# EAGLE design C64C-C128-multikernal (EAGLE 7.6.0)
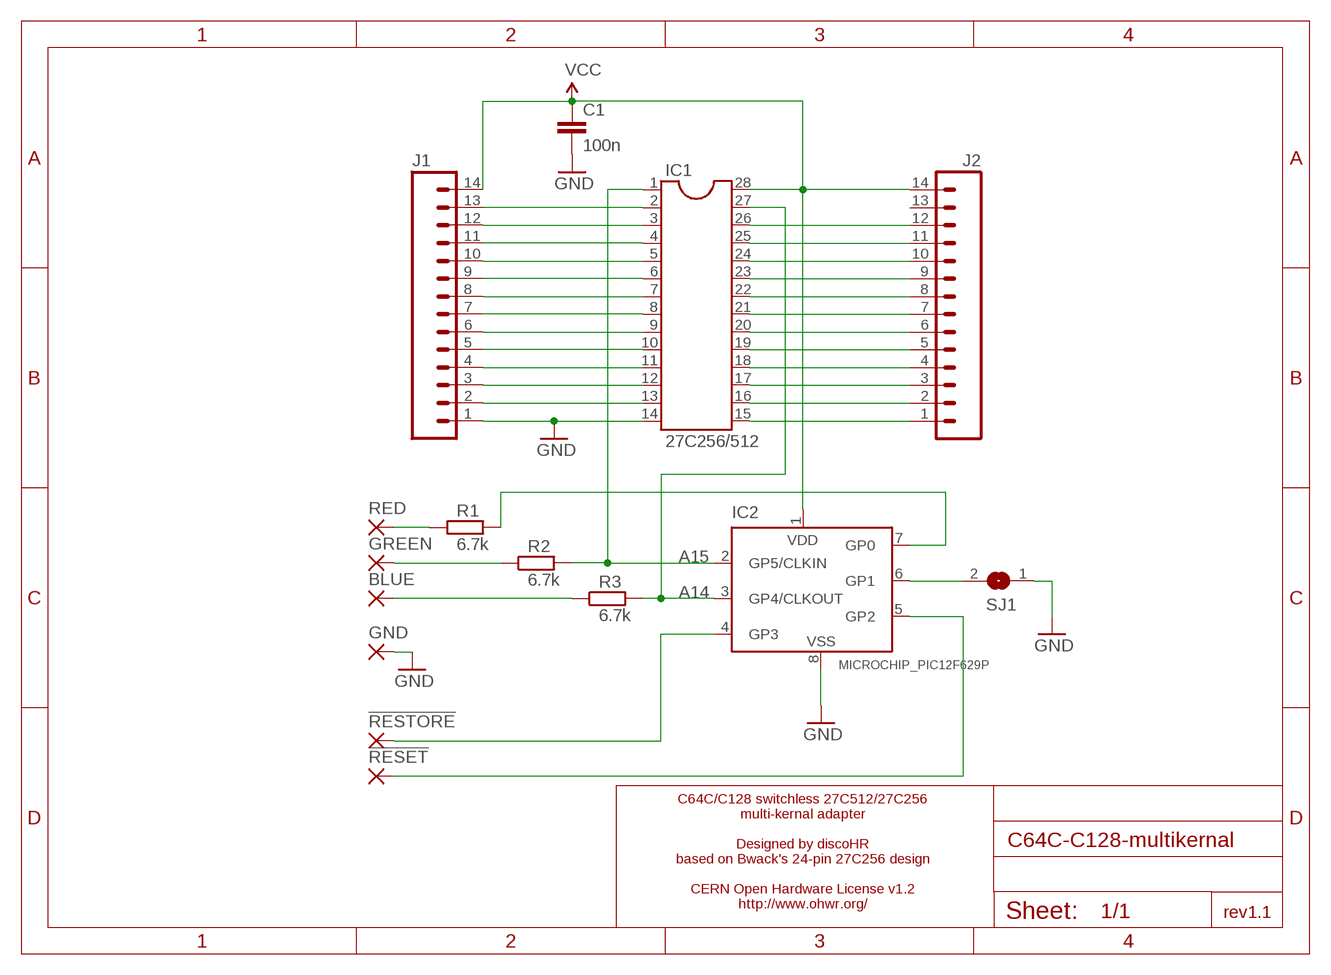
[diagram p0: schematic, sheet 1]

## Parts
!RESET!  2,15/1,0  [2,15/1,0]
!RESTORE!  2,15/1,0  [2,15/1,0]
BLUE  2,15/1,0  [2,15/1,0]
C1  100n  C-EU025-024X044  [C025-024X044]
GND  2,15/1,0  [2,15/1,0]
GREEN  2,15/1,0  [2,15/1,0]
IC1  27C256/512  IC-PACKAGE_EDIT_DIL28ROUND  [IC-PACKAGE_EDIT_DIL28SPECIAL]
IC2  MICROCHIP_PIC12F629P  [MICROCHIP_DIL8]
J1  M14  [1X14]
J2  M14  [1X14]
R1  6.7k  RCL_R-EU_0207/10  [RCL_0207/10]
R2  6.7k  RCL_R-EU_0207/10  [RCL_0207/10]
R3  6.7k  RCL_R-EU_0207/10  [RCL_0207/10]
RED  2,15/1,0  [2,15/1,0]
SJ1  SJ  [SJ]

## Nets
A14: IC1.27 IC2.3(GP4/CLKOUT) R3.2
A15: IC1.1 IC2.2(GP5/CLKIN) R2.2
GND [power]: C1.2 GND.1(P) IC1.14 IC2.8(VSS) J1.1 SJ1.1
N$1: IC2.7(GP0) R1.2
N$2: R1.1 RED.1(P)
N$3: IC1.15 J2.1
N$4: IC1.16 J2.2
N$5: IC1.17 J2.3
N$6: IC1.18 J2.4
N$7: IC1.19 J2.5
N$8: IC1.20 J2.6
N$9: IC1.21 J2.7
N$10: IC1.22 J2.8
N$11: IC1.23 J2.9
N$12: IC1.24 J2.10
N$13: IC1.25 J2.11
N$14: IC1.26 J2.12
N$15: IC1.2 J1.13
N$16: IC2.6(GP1) SJ1.2
N$17: IC1.3 J1.12
N$18: IC1.4 J1.11
N$19: IC1.5 J1.10
N$20: IC1.6 J1.9
N$21: IC1.7 J1.8
N$22: IC1.8 J1.7
N$23: IC1.9 J1.6
N$24: IC1.10 J1.5
N$25: IC1.11 J1.4
N$26: IC1.12 J1.3
N$27: IC1.13 J1.2
N$28: !RESET!.1(P) IC2.5(GP2)
N$29: GREEN.1(P) R2.1
N$30: BLUE.1(P) R3.1
N$31: !RESTORE!.1(P) IC2.4(GP3)
VCC [power]: C1.1 IC1.28 IC2.1(VDD) J1.14 J2.14
Unconnected: J2.13

## Notes on the sheet
- C64C/C128 switchless 27C512/27C256
  multi-kernal adapter
  
  Designed by discoHR
  based on Bwack's 24-pin 27C256 design
  
  CERN Open Hardware License v1.2
  http://www.ohwr.org/
- rev1.1

## Library data of the parts
!RESET! !RESTORE! BLUE GND GREEN RED = wirepad:2,15/1,0: THROUGH-HOLE PAD
C1 = rcl:C-EU: CAPACITOR, European symbol
IC1 = c64switchless:IC-PACKAGE_EDIT_DIL28: Dual In Line
IC2 = c64switchless:MICROCHIP_PIC12F6*: Data Sheet 8-Pin FLASH-Based 8-Bit CMOS Microcontrollers Source: http://www.microchip.com .. 41190c.pdf; MF: MICROCHIP; MPN: PIC12F629-I/P; OC_FARNELL: 1292253; OC_NEWARK: 67K0822
J1 J2 = SparkFun-Connectors:M14: Header 14 Standard 14-pin 0.1" header. Use with straight break away headers (SKU : PRT-00116), right angle break away headers (PRT-00553), swiss pins (PRT-00743), machine pins (PRT-00117), and female headers (PRT-00115).
R1-R3 = c64switchless:RCL_R-EU_: RESISTOR, European symbol
SJ1 = jumper:SJ: SMD solder JUMPER

## Net classes
0 default: width 0.406 mm
1 power: width 0.61 mm

## Board
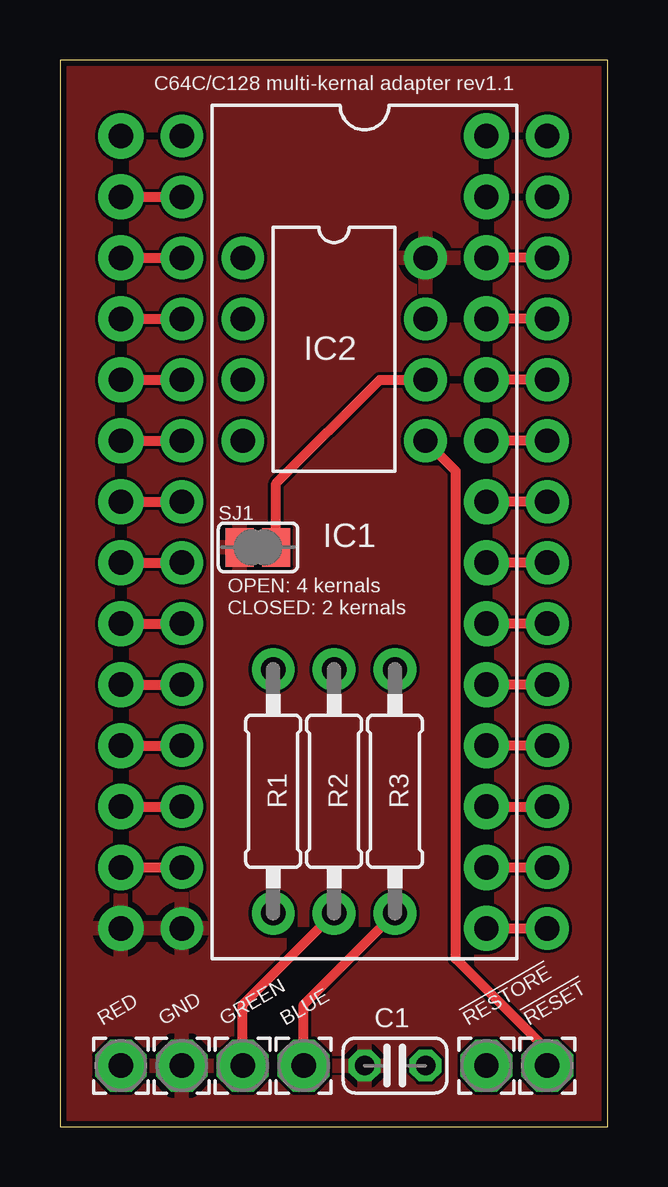
[diagram p1: board, top side]
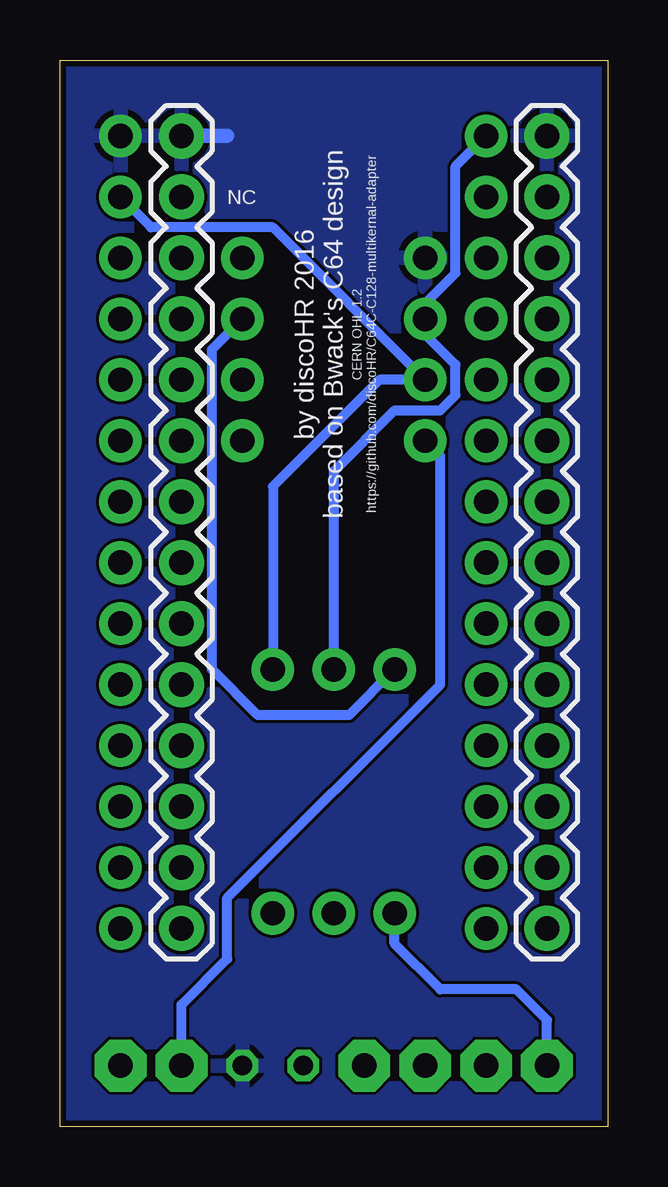
[diagram p2: board, bottom side, seen from below]

Size 22.85 x 44.44 mm. Coordinates in mm from the lower left corner, seen from the top.
Outline: 0,0 22.85,0 22.85,44.44 0,44.44 0,0
Copper layers (1*16): Top 0.035mm / dielectric 1.5mm / Bottom 0.035mm
Design rules "dirt_cheap_dirty_boards.v1": minimum track width 5mil, minimum drill 12mil, track to track 5mil, track to pad 5mil, pad to pad 5mil, via to via 5mil, smd to smd 0mil, copper to edge 10mil, drill to drill 10mil, minimum pad ring 10mil, minimum via ring 6mil, stop-mask expansion 2mil, vias tented up to drill 25mil, thermal gap 10mil

### Footprints (pad centres in the part's own frame; a part is rotated, then mirrored left to right if it is on the bottom)
2,15/1,0 = drill 1.016 pad 2.159 octagon: 1 0,0
C025-024X044 = drill 0.813 octagon: 1 -1.27,0; 2 1.27,0
IC-PACKAGE_EDIT_DIL28SPECIAL = drill 1.016 pad 1.778: 1 -16.51,-7.62; 2 -13.97,-7.62; 3 -11.43,-7.62; 4 -8.89,-7.62; 5 -6.35,-7.62; 6 -3.81,-7.62; 7 -1.27,-7.62; 8 1.27,-7.62; 9 3.81,-7.62; 10 6.35,-7.62; 11 8.89,-7.62; 12 11.43,-7.62; 13 13.97,-7.62; 14 16.51,-7.62; 15 16.51,7.62; 16 13.97,7.62; 17 11.43,7.62; 18 8.89,7.62; 19 6.35,7.62; 20 3.81,7.62; 21 1.27,7.62; 22 -1.27,7.62; 23 -3.81,7.62; 24 -6.35,7.62; 25 -8.89,7.62; 26 -11.43,7.62; 27 -13.97,7.62; 28 -16.51,7.62
MICROCHIP_DIL8 = drill 1.016 pad 1.778: 1 -3.81,-3.81; 2 -1.27,-3.81; 3 1.27,-3.81; 4 3.81,-3.81; 5 3.81,3.81; 6 1.27,3.81; 7 -1.27,3.81; 8 -3.81,3.81
1X14 = drill 1.016 pad 1.88: 1 0,0; 2 2.54,0; 3 5.08,0; 4 7.62,0; 5 10.16,0; 6 12.7,0; 7 15.24,0; 8 17.78,0; 9 20.32,0; 10 22.86,0; 11 25.4,0; 12 27.94,0; 13 30.48,0; 14 33.02,0
RCL_0207/10 = drill 1.016 pad 1.778: 1 -5.08,0; 2 5.08,0
SJ = smd 1.168 x 1.6: 1 -0.762,0; 2 0.762,0

### Placement (x,y rotation side)
!RESET!  20.32,2.54 0 top
!RESTORE!  17.78,2.54 0 top
BLUE  10.16,2.54 0 top
C1  13.97,2.54 180 top
GND  5.08,2.54 0 top
GREEN  7.62,2.54 0 top
IC1  12.7,24.77 270 top
IC2  11.43,32.38 270 top
J1  2.54,8.26 90 bottom
J2  17.78,8.26 90 bottom
R1  8.89,13.97 90 top
R2  11.43,13.97 90 top
R3  13.97,13.97 90 top
RED  2.54,2.54 0 top
SJ1  8.26,24.13 0 top

### Tracks (layer width: path | path; a pad name or v marks a point on that pad's centre or on a via)
A14
  Bottom 0.406: IC1.27 19.05,37.47 13.97,37.47 IC2.3 9.53,31.11 13.97,26.67 R3.2
A15
  Bottom 0.406: R2.2 11.43,27.3 8.89,29.84 6.99,29.84 6.35,30.48 6.35,31.75 7.62,33.02 IC2.2 7.62,34.29 6.35,35.56 6.35,40.01 IC1.1
GND
  pour Top: 0,0 22.86,0 22.86,44.45 0,44.45
N$1
  Bottom 0.406: R1.2 10.79,17.14 14.61,17.14 16.51,19.05 16.51,32.38 IC2.7
N$2
  Bottom 0.406: RED.1 2.54,4.45 3.81,5.71 6.99,5.71 8.89,7.62 R1.1
N$3
  Top 0.406: J2.1 IC1.15
N$4
  Top 0.406: J2.2 IC1.16
N$5
  Top 0.406: J2.3 IC1.17
N$6
  Top 0.406: IC1.18 J2.4
N$7
  Top 0.406: IC1.19 J2.5
N$8
  Top 0.406: IC1.20 J2.6
N$9
  Top 0.406: IC1.21 J2.7
N$10
  Top 0.406: IC1.22 J2.8
N$11
  Top 0.406: IC1.23 J2.9
N$12
  Top 0.406: IC1.24 J2.10
N$13
  Top 0.406: IC1.25 J2.11
N$14
  Top 0.406: IC1.26 J2.12
N$15
  Top 0.406: J1.13 IC1.2
N$16
  Top 0.406: SJ1.2 9.02,26.8 13.34,31.11 IC2.6
N$17
  Top 0.406: J1.12 IC1.3
N$18
  Top 0.406: J1.11 IC1.4
N$19
  Top 0.406: J1.10 IC1.5
N$20
  Top 0.406: J1.9 IC1.6
N$21
  Top 0.406: J1.8 IC1.7
N$22
  Top 0.406: J1.7 IC1.8
N$23
  Top 0.406: J1.6 IC1.9
N$24
  Top 0.406: J1.5 IC1.10
N$25
  Top 0.406: J1.4 IC1.11
N$26
  Top 0.406: J1.3 IC1.12
N$27
  Top 0.406: J1.2 IC1.13
N$28
  Top 0.406: IC2.5 16.51,27.3 16.51,6.99 20.32,3.17 !RESET!.1
N$29
  Top 0.406: GREEN.1 7.62,5.08 R2.1
N$30
  Top 0.406: BLUE.1 10.16,5.08 R3.1
N$31
  Bottom 0.406: !RESTORE!.1 17.78,5.08 15.88,6.99 15.88,9.53 6.99,18.41 6.99,27.94 IC2.4
VCC
  Bottom 0.61: 15.88,41.27 J2.14
  pour Bottom: 0,0 22.86,0 22.86,44.45 0,44.45

### Text on the board
tNames: C64C/C128 multi-kernal adapter rev1.1 | OPEN: 4 kernals / CLOSED: 2 kernals
bNames: NC | CERN OHL 1.2 / https://github.com/discoHR/C64C-C128-multikernal-adapter | by discoHR 2016 / based on Bwack's C64 design